# EAGLE design WaeatherNode (EAGLE 7.2.0)
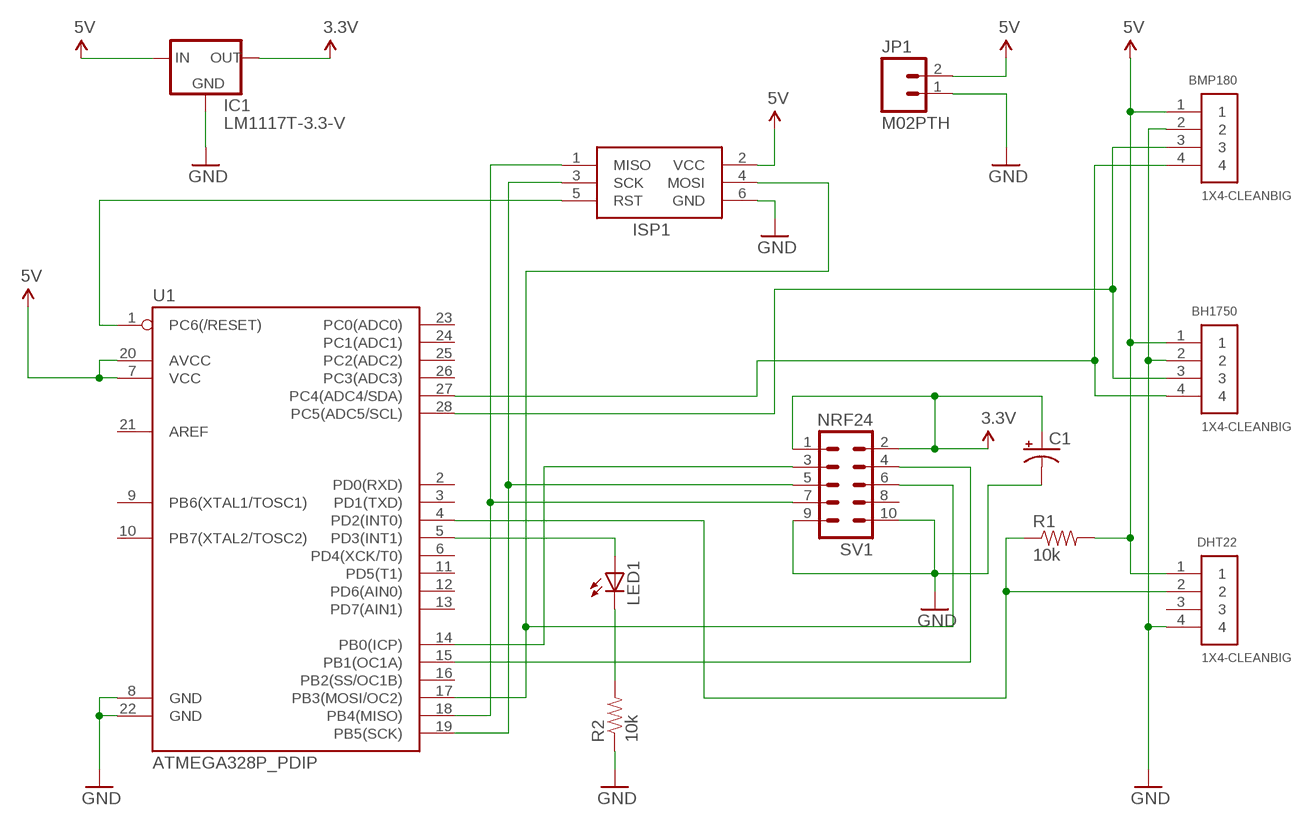
[diagram p0: schematic, sheet 1]

## Parts
BH1750  1X4-CLEANBIG  [1X04-CLEANBIG]
BMP180  1X4-CLEANBIG  [1X04-CLEANBIG]
C1  CPOL-USE2.5-7  [E2,5-7]
DHT22  1X4-CLEANBIG  [1X04-CLEANBIG]
IC1  LM1117T-3.3-V  [TO220V]
ISP1  AVRISP-BOX  [AVRISP-BOX]
JP1  M02PTH  [1X02]
LED1  LED3MM  [LED3MM]
R1  10k  10KOHM-1/4W-1%(PTH)HORIZ  [AXIAL-0.3]
R2  10k  10KOHM-1/4W-1%(PTH)HORIZ  [AXIAL-0.3]
SV1  NRF24  MA05-2  [MA05-2]
U1  ATMEGA328P_PDIP  [DIL28-3]

## Nets
3.3V: C1.+ IC1.2(OUT) SV1.1 SV1.2
5V: BH1750.1 BMP180.1 DHT22.1 IC1.3(IN) ISP1.2(VCC) JP1.2 R1.P$2 U1.7(VCC) U1.20(AVCC)
GND: BH1750.2 BMP180.2 C1.- DHT22.4 IC1.1(GND) ISP1.6(GND) JP1.1 R2.P$1 SV1.9 SV1.10 U1.8(GND) U1.22(GND)
N$1: ISP1.4(MOSI) SV1.6 U1.17(PB3(MOSI/OC2))
N$2: ISP1.5(RST) U1.1(PC6(/RESET))
N$3: ISP1.3(SCK) SV1.5 U1.19(PB5(SCK))
N$4: ISP1.1(MISO) SV1.7 U1.18(PB4(MISO))
N$5: BH1750.4 BMP180.4 U1.27(PC4(ADC4/SDA))
N$6: BH1750.3 BMP180.3 U1.28(PC5(ADC5/SCL))
N$7: SV1.3 U1.14(PB0(ICP))
N$8: SV1.4 U1.15(PB1(OC1A))
N$9: DHT22.2 R1.P$1 U1.4(PD2(INT0))
N$11: LED1.A U1.5(PD3(INT1))
N$12: LED1.K(C) R2.P$2
Unconnected: DHT22.3 SV1.8 U1.2(PD0(RXD)) U1.3(PD1(TXD)) U1.6(PD4(XCK/T0)) U1.9(PB6(XTAL1/TOSC1)) U1.10(PB7(XTAL2/TOSC2)) U1.11(PD5(T1)) U1.12(PD6(AIN0)) U1.13(PD7(AIN1)) U1.16(PB2(SS/OC1B)) U1.21(AREF) U1.23(PC0(ADC0)) U1.24(PC1(ADC1)) U1.25(PC2(ADC2)) U1.26(PC3(ADC3))

## Library data of the parts
BH1750 BMP180 DHT22 = adafruit:1X4: 4-pin connector
C1 = adafruit:CPOL-US: POLARIZED CAPACITOR, American symbol
IC1 = lm1117:LM1117T-*
ISP1 = adafruit:AVRISP: AVR ISP HEADER Standard 6 pin header for AVR programming
JP1 = SparkFun-Connectors:M02: Standard 2-pin 0.1" header. Use with - straight break away headers ( PRT-00116) - right angle break away headers (PRT-00553) - swiss pins (PRT-00743) - machine pins (PRT-00117) - female headers (PRT-00115) Molex polarized connector foot print use with: PRT-08233 with associated crimp pins and housings. 2.54_SCREWTERM for use with PRT-10571. 3.5mm Screw Terminal footprints for PRT-08084 5mm Screw Terminal footprints for use with PRT-08432
LED1 = adafruit:LED: LED OSRAM: - CHIPLED LG R971, LG N971, LY N971, LG Q971, LY Q971, LO R971, LY R971 LH N974, LH R974 LS Q976, LO Q976, LY Q976 LO Q996 - Hyper CHIPLED LW Q18S LB Q993, LB Q99A, LB R99A - SideLED LS A670, LO A670, LY A670, LG A670, LP A670 LB A673, LV A673, LT A673, LW A673 LH A674 LY A675 LS A676, LA A676, LO A676, LY A676, LW A676 LS A679, LY A679, LG A679 - Hyper Micro SIDELED® LS Y876, LA Y876, LO Y876, LY Y876 LT Y87S - SmartLED LW L88C, LW L88S LB L89C, LB L89S, LG L890 LS L89K, LO L89K, LY L89K LS L896, LA L896, LO L896, LY L896 - TOPLED LS T670, LO T670, LY T670, LG T670, LP T670 LSG T670, LSP T670, LSY T670, LOP T670, LYG T670 LG T671, LOG T671, LSG T671 LB T673, LV T673, LT T673, LW T673 LH T674 LS T676, LA T676, LO T676, LY T676, LB T676, LH T676, LSB T676, LW T676 LB T67C, LV T67C, LT T67C, LS T67K, LO T67K, LY T67K, LW E67C LS E67B, LA E67B, LO E67B, LY E67B, LB E67C, LV E67C, LT E67C LW T67C LS T679, LY T679, LG T679 LS T770, LO T770, LY T770, LG T770, LP T770 LB T773, LV T773, LT T773, LW T773 LH T774 LS E675, LA E675, LY E675, LS T675 LS T776, LA T776, LO T776, LY T776, LB T776 LHGB T686 LT T68C, LB T68C - Hyper Mini TOPLED® LB M676 - Mini TOPLED Santana® LG M470 LS M47K, LO M47K, LY M47K Source: http://www.osram.convergy.de/
R1 R2 = SparkFun-Resistors:10KOHM-1/4W-1%(PTH): RES-12183; PROD_ID: RES-12183
SV1 = con-lstb:MA05-2: PIN HEADER; OC_FARNELL: unknown; OC_NEWARK: unknown
U1 = SparkFun-DigitalIC:ATMEGA328P_PDIP: uC used in the Arduino 32kb flash, 1k EEPROM, 2k SRAM This is the through-hole version of this chip.

## Board
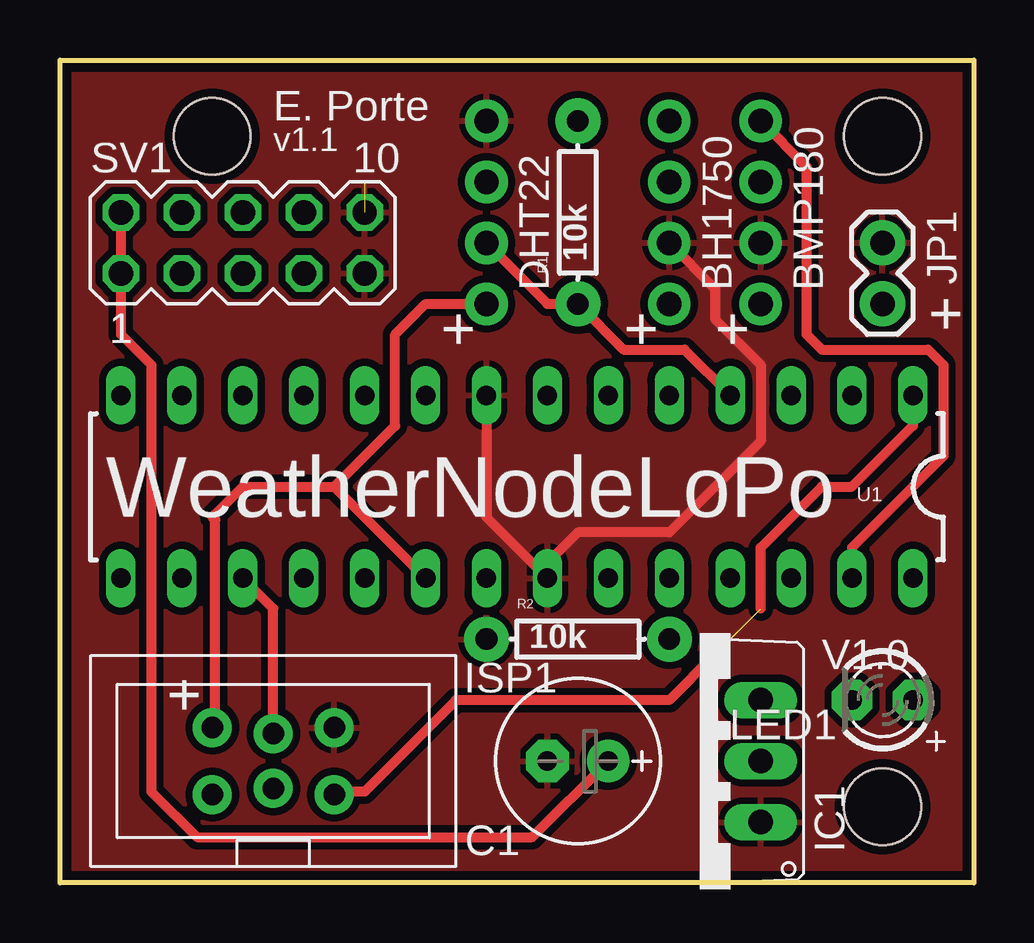
[diagram p1: board, top side]
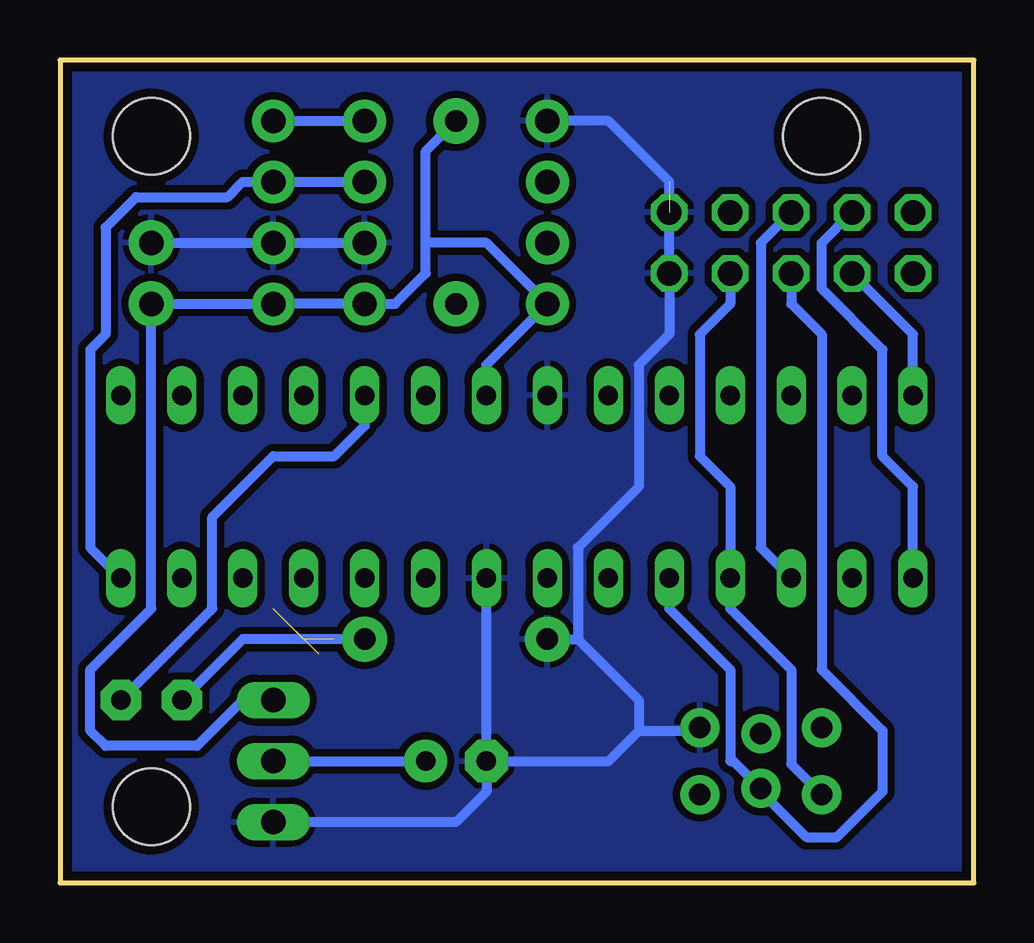
[diagram p2: board, bottom side, seen from below]

Size 38.1 x 34.29 mm. Coordinates in mm from the lower left corner, seen from the top.
Outline: 0,0 0,34.29 38.1,34.29 38.1,0 0,0
Copper layers (1*16): Top 0.0356mm / dielectric 1.5011mm / Bottom 0.0356mm
Design rules "LaenPCBOrder": minimum track width 6mil, minimum drill 13mil, track to track 6mil, track to pad 6mil, pad to pad 6mil, via to via 6mil, smd to smd 6mil, copper to edge 15mil, drill to drill 6mil, minimum pad ring 7mil, minimum via ring 7mil, stop-mask expansion 3mil, vias tented up to drill 0mil, thermal gap 10mil
Holes 3.2 mm at 6.35,31.11 34.29,31.11 34.29,3.18

### Footprints (pad centres in the part's own frame; a part is rotated, then mirrored left to right if it is on the bottom)
1X04-CLEANBIG = drill 1.016 pad 1.778: 1 -3.81,0; 2 -1.27,0; 3 1.27,0; 4 3.81,0
E2,5-7 = drill 0.813 pad 1.778: + -1.27,0 | drill 0.813 pad 1.778 octagon: - 1.27,0
TO220V = drill 1.016 long: 1 -2.54,-2.54; 2 0,-2.54; 3 2.54,-2.54
AVRISP-BOX = drill 0.9 pad 1.626: 1 -1.397,2.54; 2 1.397,2.54; 3 -1.143,0; 4 1.143,0; 5 -1.397,-2.54; 6 1.397,-2.54
1X02 = drill 1.016 pad 1.88: 1 0,0; 2 2.54,0
LED3MM = drill 0.813 pad 1.676 octagon: A -1.27,0; K 1.27,0
AXIAL-0.3 = drill 0.9 pad 1.88: P$1 -3.81,0; P$2 3.81,0
MA05-2 = drill 1.016 octagon: 1 -5.08,-1.27; 2 -5.08,1.27; 3 -2.54,-1.27; 4 -2.54,1.27; 5 0,-1.27; 6 0,1.27; 7 2.54,-1.27; 8 2.54,1.27; 9 5.08,-1.27; 10 5.08,1.27
DIL28-3 = drill 0.813 long: 1 -16.51,-3.81; 2 -13.97,-3.81; 3 -11.43,-3.81; 4 -8.89,-3.81; 5 -6.35,-3.81; 6 -3.81,-3.81; 7 -1.27,-3.81; 8 1.27,-3.81; 9 3.81,-3.81; 10 6.35,-3.81; 11 8.89,-3.81; 12 11.43,-3.81; 13 13.97,-3.81; 14 16.51,-3.81; 15 16.51,3.81; 16 13.97,3.81; 17 11.43,3.81; 18 8.89,3.81; 19 6.35,3.81; 20 3.81,3.81; 21 1.27,3.81; 22 -1.27,3.81; 23 -3.81,3.81; 24 -6.35,3.81; 25 -8.89,3.81; 26 -11.43,3.81; 27 -13.97,3.81; 28 -16.51,3.81

### Placement (x,y rotation side)
BH1750  25.4,27.94 90 top
BMP180  29.21,27.94 90 top
C1  21.59,5.08 180 top
DHT22  17.78,27.94 90 top
IC1  26.67,5.08 90 top
ISP1  8.89,5.08 90 top
JP1  34.29,26.67 270 top
LED1  34.29,7.62 180 top
R1  21.59,27.94 90 top
R2  21.59,10.16 0 top
SV1  7.62,26.67 0 top
U1  19.05,16.51 180 top

### Tracks (layer width: path | path; a pad name or v marks a point on that pad's centre or on a via)
3.3V
  Top 0.406: C1.+ 19.69,1.91 5.71,1.91 3.81,3.81 3.81,21.59 2.54,22.86 SV1.1 SV1.2
  Bottom 0.406: IC1.2 C1.+
5V
  Top 0.406: ISP1.2 6.48,6.48 6.48,15.11 6.35,15.24 7.62,16.51 11.43,16.51 | 11.43,16.51 13.97,19.05 13.97,22.86 15.24,24.13 DHT22.1 | U1.20 11.43,16.51
  Bottom 0.406: 22.86,26.67 22.86,25.4 24.13,24.13 BH1750.1 BMP180.1 JP1.2 34.29,11.43 36.83,8.89 36.83,6.35 36.2,5.71 32.38,5.71 30.48,7.62 IC1.3 | 22.86,26.67 22.86,30.48 R1.P$2 | 22.86,26.67 20.32,26.67 DHT22.1 20.32,21.59 U1.7
GND  (1 unrouted)
  Top 0.406: U1.8 17.78,15.24 U1.22 20.32,13.33 21.59,14.61 25.4,14.61 29.21,18.42 29.21,21.59 27.3,23.5 27.3,24.76 BH1750.2
  Bottom 0.406: C1.- 15.24,5.08 13.97,6.35 | 13.97,6.35 11.56,6.35 ISP1.6 | BH1750.2 BMP180.2 JP1.1 | DHT22.4 15.24,31.75 12.7,29.21 SV1.9 12.7,22.86 13.97,21.59 13.97,16.51 16.51,13.97 16.51,10.16 | C1.- 20.32,3.81 21.59,2.54 IC1.1 | C1.- U1.22 | R2.P$1 16.51,10.16 | 16.51,10.16 13.97,7.62 13.97,6.35
  pour Bottom (isolate 0.305): 0,34.29 0,0 38.1,0 38.1,34.29
  pour Top (isolate 0.305): 0,34.29 0,0 38.1,0 38.1,34.29
N$1
  Top 0.406: ISP1.4 8.89,11.43 U1.17
  Bottom 0.406: SV1.6 8.89,26.67 8.89,13.97 U1.17
N$2  (3 unrouted)
  Top 0.406: U1.1 35.56,19.05 33.02,16.51 31.75,16.51 29.21,13.97 29.21,11.43 | ISP1.5 11.56,3.81 12.7,3.81 16.51,7.62 25.4,7.62 27.3,9.52
N$3
  Bottom 0.406: SV1.5 7.62,24.13 6.35,22.86 6.35,8.89 3.81,6.35 3.81,3.81 5.71,1.91 6.98,1.91 8.89,3.81 ISP1.3 10.03,5.08 10.16,5.08 10.16,8.89 12.7,11.43 U1.19
N$4
  Bottom 0.406: SV1.7 10.16,24.13 11.43,22.86 11.43,17.78 10.16,16.51 U1.18 10.16,11.43 7.62,8.89 7.62,4.95 ISP1.1
N$5
  Top 0.406: BMP180.4 31.12,29.85 31.12,22.86 31.75,22.22 36.2,22.22 36.83,21.59 36.83,17.78 33.02,13.97 U1.27
  Bottom 0.406: BMP180.4 BH1750.4
N$6
  Bottom 0.406: BH1750.3 BMP180.3 30.48,29.21 31.12,28.57 34.92,28.57 36.2,27.31 36.2,22.86 36.83,22.22 36.83,13.97 U1.28
N$7
  Bottom 0.406: U1.14 2.54,22.86 SV1.3
N$8
  Bottom 0.406: U1.15 2.54,16.51 3.81,17.78 3.81,22.22 6.35,24.76 6.35,26.67 SV1.4
N$9
  Top 0.406: DHT22.2 20.32,24.13 R1.P$1 23.49,22.22 26.03,22.22 U1.4
N$11
  Bottom 0.406: LED1.A 31.75,11.43 31.75,15.24 29.21,17.78 26.67,17.78 25.4,19.05 U1.5
N$12
  Bottom 0.406: LED1.K 30.48,10.16 R2.P$2

### Text on the board
tPlace: E. Porte | v1.1 | WeatherNodeLoPo | V1.0
tNames: + | + | + | + | +